# Altium schematic sheet 01_BlockDiagram.SchDoc: Block diagram
size A4; Organization: Lime Microsystems; Address1: Surrey Tech Centre; Address2: Guildford GU2 7YG; Address3: Surrey; Address4: United Kingdom; Revision: v1.2; SheetNumber: 1; SheetTotal: 27
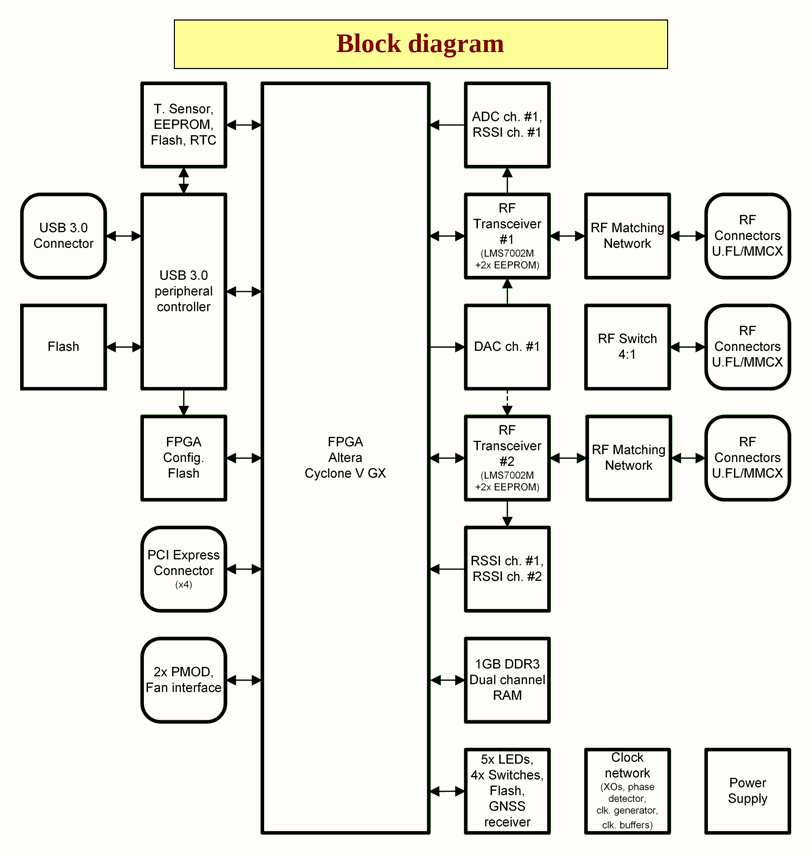
[diagram p0: 01_BlockDiagram.SchDoc]

## Notes on the sheet
- Block diagram
- Project name:
- Title:
- Size:
- Date:
- A4
- Revision:
- Time:
- Sheet
- of
- File: